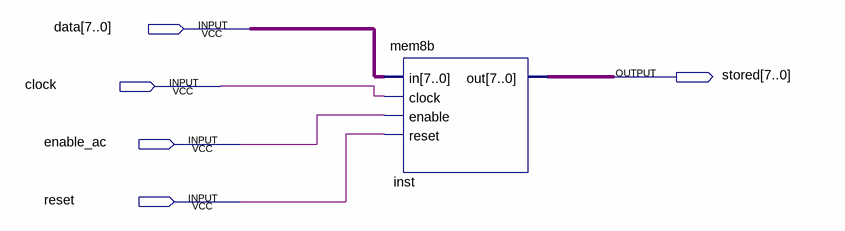
[diagram p0: schematic sheet]
// Quartus schematic ac.bdf as structural Verilog: 1 symbols, 5 pins
module ac (
  input  [7:0] data,
  input  clock,
  input  enable_ac,
  input  reset,
  output [7:0] stored
);

  mem8b inst (.in(data), .clock(clock), .enable(enable_ac), .reset(reset), .out(stored));
endmodule
